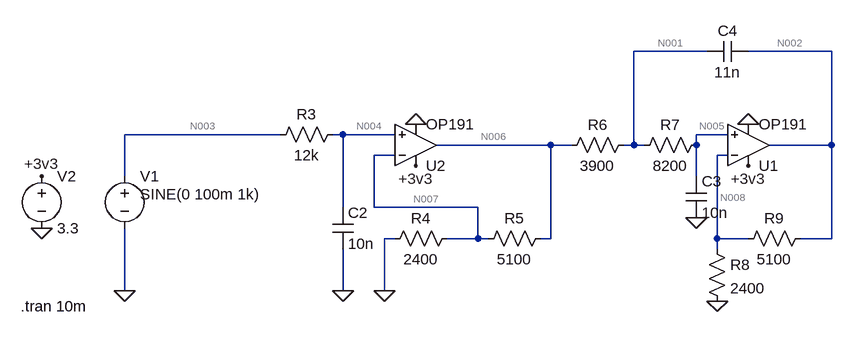
[diagram p0: schematic Draft1.asc]
Draft1.asc, the LTspice schematic file:
Version 4
SHEET 1 1184 680
WIRE 528 16 416 16
WIRE 720 16 592 16
WIRE -128 144 -368 144
WIRE -32 144 -48 144
WIRE 48 144 -32 144
WIRE 560 144 512 144
WIRE 288 160 112 160
WIRE 320 160 288 160
WIRE 416 160 416 16
WIRE 416 160 400 160
WIRE 432 160 416 160
WIRE 512 160 512 144
WIRE 720 160 720 16
WIRE 720 160 624 160
WIRE 48 176 16 176
WIRE 560 176 544 176
WIRE -368 208 -368 144
WIRE 512 208 512 160
WIRE -32 256 -32 144
WIRE 16 256 16 176
WIRE 176 256 16 256
WIRE 48 304 32 304
WIRE 176 304 176 256
WIRE 176 304 128 304
WIRE 192 304 176 304
WIRE 288 304 288 160
WIRE 288 304 272 304
WIRE 544 304 544 176
WIRE 592 304 544 304
WIRE 720 304 720 160
WIRE 720 304 672 304
WIRE 544 320 544 304
WIRE -368 384 -368 288
WIRE -32 384 -32 320
WIRE 32 384 32 304
FLAG -368 384 0
FLAG -496 288 0
FLAG -496 208 +3v3
FLAG 80 128 0
FLAG 80 192 +3v3
FLAG -32 384 0
FLAG 32 384 0
FLAG 544 400 0
FLAG 512 272 0
FLAG 592 128 0
FLAG 592 192 +3v3
SYMBOL voltage -368 192 R0
WINDOW 3 24 44 Left 2
WINDOW 123 24 180 Left 2
WINDOW 39 0 0 Left 0
SYMATTR Value SINE(0 100m 1k)
SYMATTR InstName V1
SYMBOL voltage -496 192 R0
WINDOW 123 0 0 Left 0
WINDOW 39 0 0 Left 0
SYMATTR InstName V2
SYMATTR Value 3.3
SYMBOL OpAmps\\OP191 80 224 M180
SYMATTR InstName U2
SYMBOL res -32 128 R90
WINDOW 0 0 56 VBottom 2
WINDOW 3 32 56 VTop 2
SYMATTR InstName R3
SYMATTR Value 12k
SYMBOL cap -48 256 R0
SYMATTR InstName C2
SYMATTR Value 10n
SYMBOL res 144 288 R90
WINDOW 0 0 56 VBottom 2
WINDOW 3 32 56 VTop 2
SYMATTR InstName R4
SYMATTR Value 2400
SYMBOL res 288 288 R90
WINDOW 0 0 56 VBottom 2
WINDOW 3 32 56 VTop 2
SYMATTR InstName R5
SYMATTR Value 5100
SYMBOL res 416 144 R90
WINDOW 0 0 56 VBottom 2
WINDOW 3 32 56 VTop 2
SYMATTR InstName R6
SYMATTR Value 3900
SYMBOL res 528 144 R90
WINDOW 0 0 56 VBottom 2
WINDOW 3 32 56 VTop 2
SYMATTR InstName R7
SYMATTR Value 8200
SYMBOL OpAmps\\OP191 592 224 M180
SYMATTR InstName U1
SYMBOL cap 496 208 R0
SYMATTR InstName C3
SYMATTR Value 10n
SYMBOL res 528 304 R0
SYMATTR InstName R8
SYMATTR Value 2400
SYMBOL res 688 288 R90
WINDOW 0 0 56 VBottom 2
WINDOW 3 32 56 VTop 2
SYMATTR InstName R9
SYMATTR Value 5100
SYMBOL cap 592 0 R90
WINDOW 0 0 32 VBottom 2
WINDOW 3 32 32 VTop 2
SYMATTR InstName C4
SYMATTR Value 11n
TEXT -528 408 Left 2 !.tran 10m

The netlist it stands for:
* Draft1.asc
V1 N003 0 SINE(0 100m 1k)
V2 +3v3 0 3.3
XU2 N004 N007 +3v3 0 N006 OP191  ; pins In+ In- V+ V- OUT
R3 N004 N003 12k
C2 N004 0 10n
R4 N007 0 2400
R5 N006 N007 5100
R6 N001 N006 3900
R7 N005 N001 8200
XU1 N005 N008 +3v3 0 N002 OP191  ; pins In+ In- V+ V- OUT
C3 N005 0 10n
R8 N008 0 2400
R9 N002 N008 5100
C4 N002 N001 11n
.tran 10m
.lib ADI.lib
.backanno
.end

* Results of the author's LTspice run, read from the files saved beside the schematic
* Operating Point, zero values left out:
*   V(+3v3) = 3.3 V
*   V(n007) = 20.18 mV
*   V(n004) = 490.2 µV
*   V(n006) = 62.96 mV
*   V(n001) = 63.08 mV
*   V(n005) = 63.33 mV
*   V(n008) = 63.35 mV
*   V(n002) = 197.8 mV
*   I(R9) = 26.37 µA
*   I(R8) = 26.4 µA
*   I(R7) = 30.03 nA
*   I(R6) = 30.03 nA
*   I(R5) = 8.389 µA
*   I(R4) = 8.408 µA
*   I(R3) = 40.85 nA
*   I(V2) = -495 µA
*   I(V1) = 40.85 nA
*   Ix(u2:1) = -40.85 nA
*   Ix(u2:2) = -19.17 nA
*   Ix(u2:99) = 238.5 µA
*   Ix(u2:50) = -225.3 µA
*   Ix(u2:45) = -8.359 µA
*   Ix(u1:1) = -30.03 nA
*   Ix(u1:2) = -29.99 nA
*   Ix(u1:99) = 256.5 µA
*   Ix(u1:50) = -230 µA
*   Ix(u1:45) = -26.37 µA
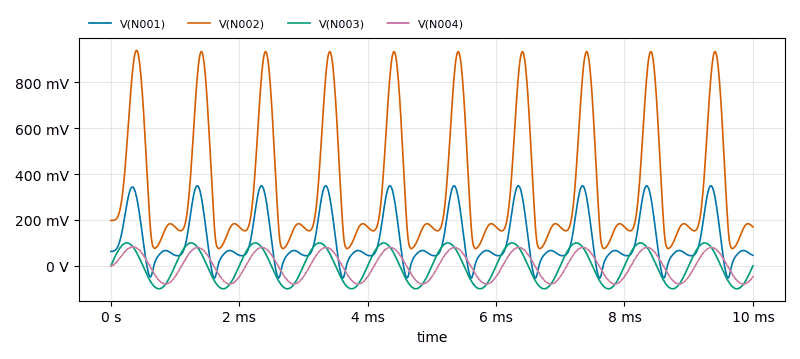
[diagram p1: Transient Analysis of Draft1.asc, plotted from the saved traces]
* Transient Analysis, 1 run:
*   V(N001): min -52.46 mV, max 348.8 mV, average 110.9 mV, rms 159.1 mV, last 46.05 mV
*   V(N002): min 75.31 mV, max 939.4 mV, average 351.4 mV, rms 452.7 mV, last 169.6 mV
*   V(N003): min -99.98 mV, max 99.98 mV, average -624.5 nV, rms 70.71 mV, last 0 V
*   V(N004): min -79.12 mV, max 82.75 mV, average 1.087 mV, rms 56.44 mV, last -47.4 mV